# Altium schematic sheet Urukul_FPGA_Supply.SchDoc: Fastino
size 420 x 297 mm; Author: G.Kasprowicz; CompanyName: WUT ISE; DrawnBy: G.Kasprowicz; Organization: WUT ISE; Address1: PW ISE; Address2: Nowowiejska 15/19 00-665 Warsaw; Address3: gkasprow@gmail.com; DocumentNumber: 8; Revision: 2; SheetNumber: 9; SheetTotal: 11; ModifiedBy: -; CheckedDate: -; Title2: FPGA supply; DivGrp: WUT ISE; Designer: G.Kasprowicz; ModifiedDate: -; ProjectName: Sensor Box
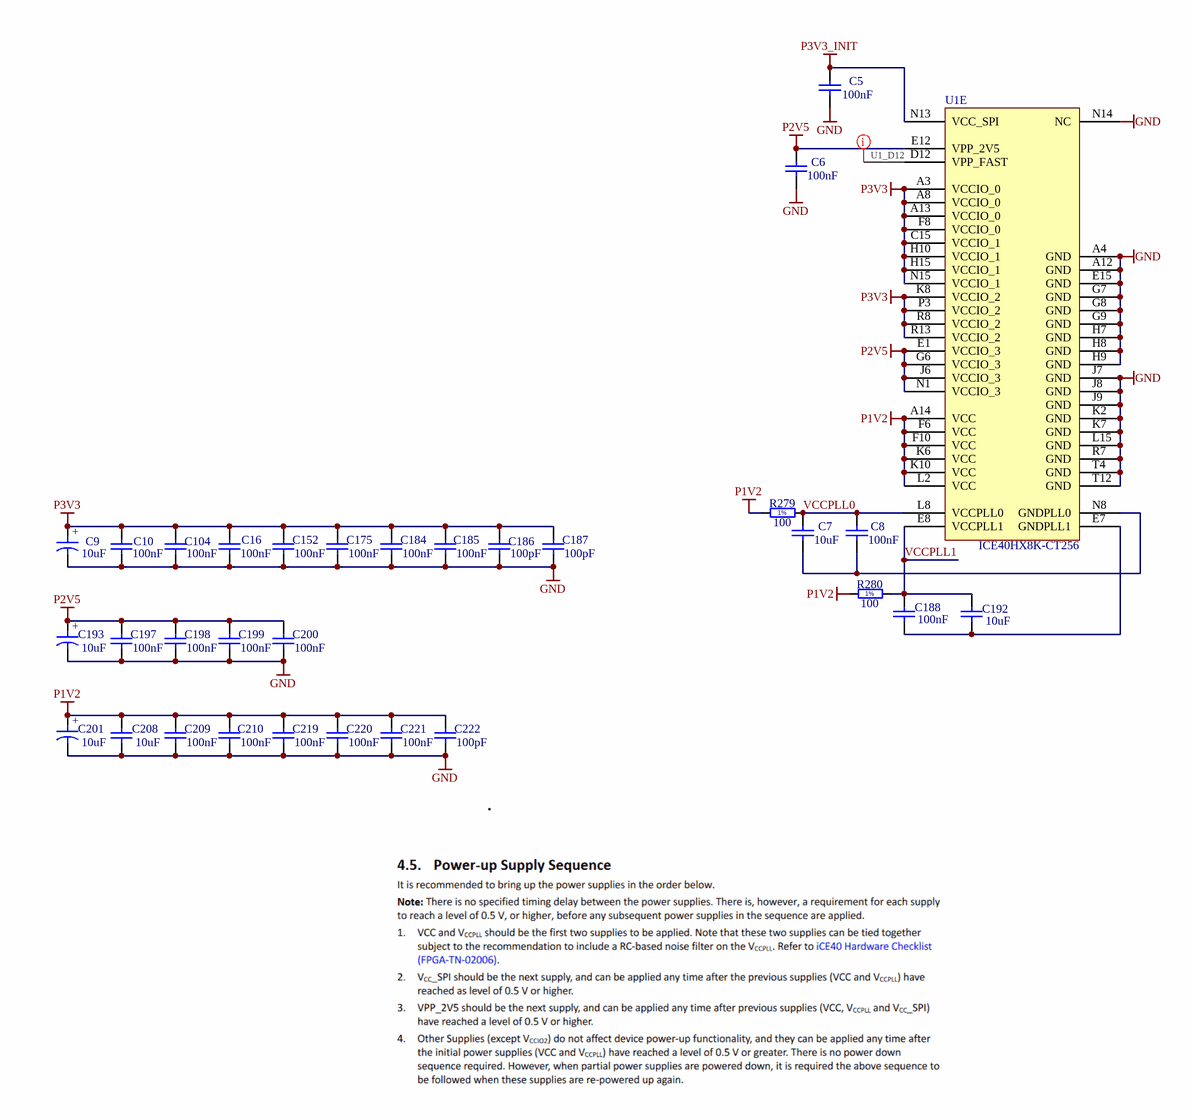
[diagram p0: Urukul_FPGA_Supply.SchDoc]

## Parts
C5  100nF  [CAPC1005X55N]
C6  100nF  [CAPC1005X55N]
C7  10uF  [CAPC1005X70N]
C8  100nF  [CAPC1005X55N]
C9  10uF  [CAPMP3216X180N]
C10  100nF  [CAPC1005X55N]
C16  100nF  [CAPC1005X55N]
C104  100nF  [CAPC1005X55N]
C152  100nF  [CAPC1005X55N]
C175  100nF  [CAPC1005X55N]
C184  100nF  [CAPC1005X55N]
C185  100nF  [CAPC1005X55N]
C186  100pF  [CAPC1005X55N]
C187  100pF  [CAPC1005X55N]
C188  100nF  [CAPC1005X55N]
C192  10uF  [CAPC1005X70N]
C193  10uF  [CAPMP3216X180N]
C197  100nF  [CAPC1005X55N]
C198  100nF  [CAPC1005X55N]
C199  100nF  [CAPC1005X55N]
C200  100nF  [CAPC1005X55N]
C201  10uF  [CAPMP3216X180N]
C208  10uF  [CAPC2012X135N]
C209  100nF  [CAPC1005X55N]
C210  100nF  [CAPC1005X55N]
C219  100nF  [CAPC1005X55N]
C220  100nF  [CAPC1005X55N]
C221  100nF  [CAPC1005X55N]
C222  100pF  [CAPC1005X55N]
R279  100  [RESC1005X40N]
R280  100  [RESC1005X40N]
U1  ICE40HX8K-CT256  [LATC-caBGA-256]  (part E of 5)

## Nets
GND: C5.1 C6.1 C9.2 C10.1 C16.1 C104.1 C152.1 C175.1 C184.1 C185.1 C186.1 C187.1 C193.2 C197.1 C198.1 C199.1 C200.1 C201.2 C208.1 C209.1 C210.1 C219.1 C220.1 C221.1 C222.1 U1.A4(GND) U1.A12(GND) U1.E15(GND) U1.G7(GND) U1.G8(GND) U1.G9(GND) U1.H7(GND) U1.H8(GND) U1.H9(GND) U1.J7(GND) U1.J8(GND) U1.J9(GND) U1.K2(GND) U1.K7(GND) U1.L15(GND) U1.N14(NC) U1.R7(GND) U1.T4(GND) U1.T12(GND)
P1V2: C201.1 C208.2 C209.2 C210.2 C219.2 C220.2 C221.2 C222.2 R279.1 R280.1 U1.A14(VCC) U1.F6(VCC) U1.F10(VCC) U1.K6(VCC) U1.K10(VCC) U1.L2(VCC)
P2V5: C6.2 C193.1 C197.2 C198.2 C199.2 C200.2 U1.E1(VCCIO_3) U1.E12(VPP_2V5) U1.G6(VCCIO_3) U1.J6(VCCIO_3) U1.N1(VCCIO_3)
P3V3: C9.1 C10.2 C16.2 C104.2 C152.2 C175.2 C184.2 C185.2 C186.2 C187.2 U1.A3(VCCIO_0) U1.A8(VCCIO_0) U1.A13(VCCIO_0) U1.C15(VCCIO_1) U1.F8(VCCIO_0) U1.H10(VCCIO_1) U1.H15(VCCIO_1) U1.K8(VCCIO_2) U1.N15(VCCIO_1) U1.P3(VCCIO_2) U1.R8(VCCIO_2) U1.R13(VCCIO_2)
P3V3_INIT: C5.2 U1.N13(VCC_SPI)
U1_D12: U1.D12(VPP_FAST)
VCCPLL0: C7.2 C8.2 R279.2 U1.L8(VCCPLL0)
VCCPLL1: C188.2 C192.2 R280.2 U1.E8(VCCPLL1)
NetC7_1: C7.1 C8.1 U1.N8(GNDPLL0)
NetC188_1: C188.1 C192.1 U1.E7(GNDPLL1)

## Layout directives
net class Unused: U1_D12

## Notes on the sheet
- Project/Equipment
- Document
- Designer
- Drawn by
- Check.by
- Copyright WUT ISE 2024.
  This documentation describes Open Hardware and is licensed under the CERN OHL v.2. You may redistribute and modify this documentation under the terms of the CERN OHL v.2. (http://ohwr.org/CERNOHL). This documentation is distributed WITHOUT ANY EXPRESS OR IMPLIED WARRANTY, INCLUDING OF MERCHANTABILITY, SATISFACTORY QUALITY AND FITNESS FOR A PARTICULAR PURPOSE. Please see the CERN OHL v.2 for applicable conditions.
- Contact
- File
- Last Mod.
- Print Date
- Sheet
- Size
- A3
- of
- Rev
- (in symbol CTE3216-18_10UF_16V_20%_AVX_TCJ) +
- (in symbol R0402_100R_1%_0.0625W_100PPM) 1%

## Library data of the parts
C5 C6 C8 C10 C16 C104 C152 C175 C184 C185 C188 C197-C200 C209 C210 C219-C221 = CC0402_100NF_16V_10%_X5R: Non-polarised capacitor; Part Description: SMD Multilayer Chip Ceramic Capacitor; Manufacturer: GENERIC; Manufacturer1 Part Number: GRM155R61C104KA88D; Voltage: 16V; TC: X5R; Tolerance: ±10%; Table: Capacitors SMD; Part Number: CC0402_100NF_16V_10%_X5R; Component Kind: Standard; Component Type: Standard; Pin Count: 2; Value: 100nF; Status: None; Manufacturer Part Number: CC0402_100NF_16V_10%_X5R; Case: 0402; Mounted: Yes; Socket: No; SMD: Yes; Manufacturer1 Example: MURATA; Manufacturer1 ComponentHeight: 0.55mm; HelpURL: \\cern.ch\dfs\Applications\Altium\Datasheets\CC0402_X5R_MURATA_GRM.pdf; Author: CERN DEM JLC; CreateDate: 2013-12-10; LatestRevisionDate: 2013-12-10
C7 C192 = CC0402_10UF_6.3V_20%_X5R: Non-polarised capacitor; Part Description: SMD Multilayer Chip Ceramic Capacitor; Manufacturer: GENERIC; Manufacturer1 Part Number: C1005X5R0J106M050BC; Voltage: 6.3V; TC: X5R; Tolerance: ±10%; Part Number: CC0402_10UF_6.3V_20%_X5R; Component Kind: Standard; Component Type: Standard; Pin Count: 2; Value: 10uF; Status: Preferred; Manufacturer Part Number: CC0402_10UF_6.3V_20%_X5R; Case: 0402; Mounted: Yes; Socket: No; SMD: Yes; Manufacturer1 Example: TDK; Manufacturer1 ComponentHeight: 0.70mm; HelpURL: \\cern.ch\dfs\Applications\Altium\Datasheets\CC0402_X5R_TDK_C.pdf; Author: CERN DEM JLC; CreateDate: 07.01.2015; LatestRevisionDate: 07.01.2015; Sense: No
C9 C193 C201 = CTE3216-18_10UF_16V_20%_AVX_TCJ: Polarised capacitor; Part Description: ESR 0R200 Tantalum Solid Electrolytic Chip Capacitor with Conductive Polymer Electrode; Manufacturer: AVX; Manufacturer Part Number: TCJA106M016R0200 or  or TR3A106K016C1700; Voltage: 16V; Tolerance: ±20%; Part Number: CTE3216-18_10UF_16V_20%_AVX_TCJ; Component Kind: Standard; Component Type: Standard; Pin Count: 2; Value: 10uF; Status: Preferred; Case: A; Mounted: Yes; Socket: No; SMD: Yes; Sense: No; ComponentHeight: 1.8mm; HelpURL: \\cern.ch\dfs\Applications\Altium\Datasheets\CTE_AVX_TCJ.pdf; Author: CERN DEM JLC; CreateDate: 29.03.2012; LatestRevisionDate: 29.03.2012
C186 C187 C222 = CC0402_100PF_50V_5%_C0G: Non-polarised capacitor; Part Description: SMD Multilayer Chip Ceramic Capacitor; Manufacturer: GENERIC; Manufacturer1 Part Number: C0402C101J5GACTU; Voltage: 50V; TC: C0G/NP0; Tolerance: ±5%; Part Number: CC0402_100PF_50V_5%_C0G; Component Kind: Standard; Component Type: Standard; Pin Count: 2; Value: 100pF; Status: Preferred; Manufacturer Part Number: CC0402_100PF_50V_5%_C0G; Case: 0402; Mounted: Yes; Socket: No; SMD: Yes; Manufacturer1 Example: KEMET; Manufacturer1 ComponentHeight: 0.55mm; HelpURL: \\cern.ch\dfs\Applications\Altium\Datasheets\CC0402_C0G_KEMET_(Commercial Grade).pdf; Author: CERN DEM JLC; CreateDate: 03.12.2007; LatestRevisionDate: 22.04.2015; Sense: No
C208 = CC0805_10UF_16V_10%_X5R: Non-polarised capacitor; Part Description: SMD Multilayer Chip Ceramic Capacitor; Manufacturer: GENERIC; Manufacturer1 Part Number: C0805C106K4PAC; Voltage: 16V; TC: X5R; Tolerance: ±10%; Part Number: CC0805_10UF_16V_10%_X5R; Component Kind: Standard; Component Type: Standard; Pin Count: 2; Value: 10uF; Status: Preferred; Manufacturer Part Number: CC0805_10UF_16V_10%_X5R; Case: 0805; Mounted: Yes; Socket: No; SMD: Yes; Manufacturer1 Example: KEMET; Manufacturer1 ComponentHeight: 1.4mm; HelpURL: \\cern.ch\dfs\Applications\Altium\Datasheets\CC1206_X5R_KEMET.pdf; Author: CERN DEM JLC; CreateDate: 03.12.2007; LatestRevisionDate: 03.12.2007; Sense: No
R279 R280 = R0402_100R_1%_0.0625W_100PPM: Resistor - 1%; Part Description: General Purpose Thick Film Chip Resistor; Manufacturer: GENERIC; Manufacturer1 Part Number: 232270671001L; TC: ±100ppm/°C; Table: Resistors SMD; Part Number: R0402_100R_1%_0.0625W_100PPM; Component Kind: Standard; Component Type: Standard; Pin Count: 2; Value: 100; Status: Not recommended; Power: 0.0625W; Tolerance: ±1%; Manufacturer Part Number: R0402_100R_1%_0.0625W_100PPM; Case: 0402; Mounted: Yes; Socket: No; SMD: Yes; Manufacturer1 Example: YAGEO PHYCOMP; Manufacturer1 ComponentHeight: 0.4mm; HelpURL: \\cern.ch\dfs\Applications\Altium\Datasheets\R0402_Phycomp_RC0402.pdf; Author: CERN DEM JLC; CreateDate: 2007-12-03; LatestRevisionDate: 2012-10-17
U1 = CMP-0962-00001-1: iCE40 HX8K Series FPGA Family, 7680 Logic Cells, 1.2 V Core, 128 K Embedded RAM Bits, 256-ball caBGA, Pb-Free, Tray; Manufacturer: Lattice Semiconductor; Supply Voltage: 1.2V; Phase-Locked Loops: 2; Logic Cells: 7680; Embedded RAM Bits: 128K; PackageReference: caBGA-256; PackageDescription: 256-Ball Chip Array Ball Grid Array, Body 14 x 14 mm, Pitch 0.8 mm; RoHS: TRUE; Packing: Tray; Mounting Technology: Surface Mount; ComponentLink3URL: http://www.latticesemi.com/lit/docs/package/pkg.pdf; ComponentLink1Description: Manufacturer URL; ComponentLink3Description: Package Specification; Code_JEDEC: MO-275; PackageVersion: Rev. 03.9, 02/2013; ComponentLink1URL: http://www.latticesemi.com/en; ComponentLink2URL: http://www.latticesemi.com/~/media/Documents/DataSheets/iCE/iCE40LPHXFamilyDataSheet.pdf; Manufacturer Part Number: ICE40HX8K-CT256; ComponentLink2Description: Datasheet; DatasheetVersion: Rev. 02.9; Part Number: ICE40HX8K-CT256